# EAGLE schematic digital (EAGLE 7.4.0)
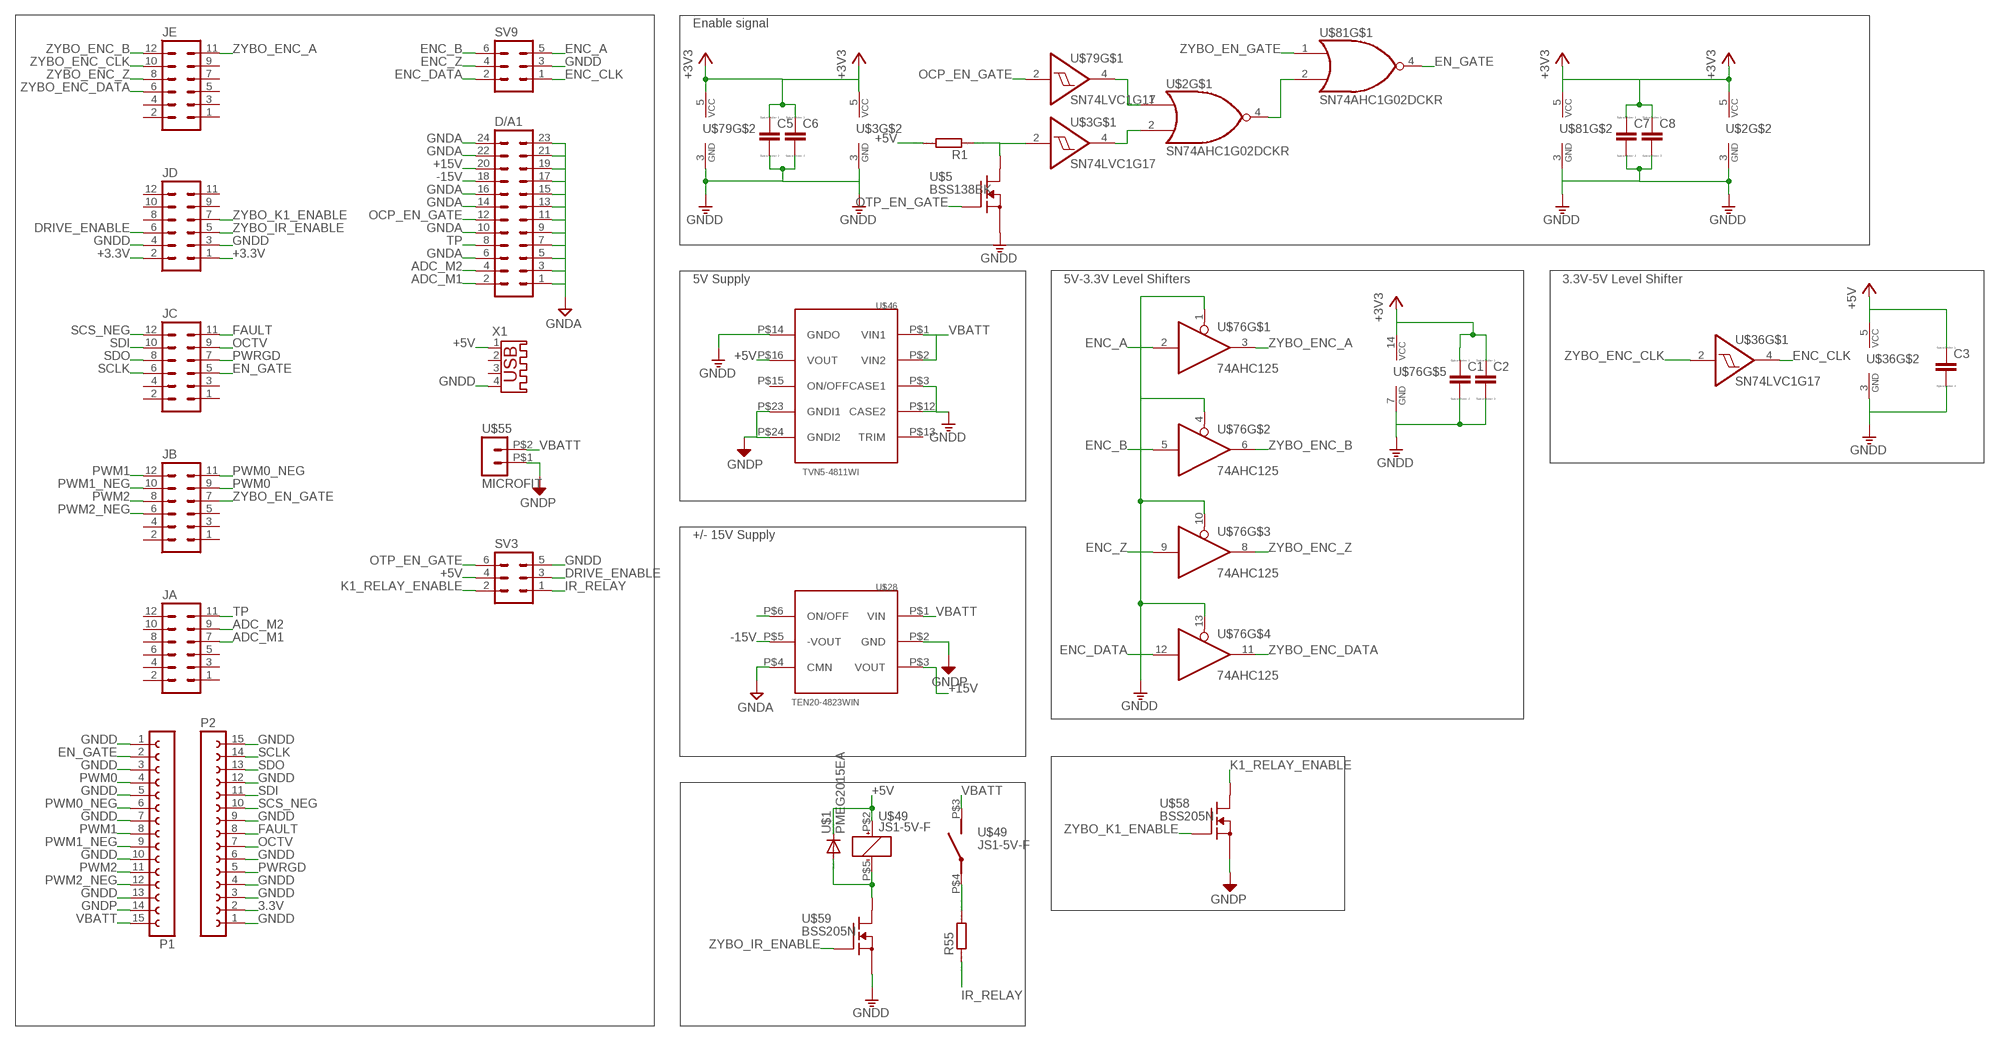
[diagram p0: schematic, sheet 1]

## Parts
C1  CC1206  [C1206]
C2  CC1206  [C1206]
C3  CC1206  [C1206]
C5  CC1206  [C1206]
C6  CC1206  [C1206]
C7  CC1206  [C1206]
C8  CC1206  [C1206]
D/A1  MA12-2  [MA12-2]
JA  MA06-2  [MA06-2]
JB  MA06-2  [MA06-2]
JC  MA06-2  [MA06-2]
JD  MA06-2  [MA06-2]
JE  MA06-2  [MA06-2]
P1  FE15-1  [FE15]
P2  FE15-1  [FE15]
R1  RR1206  [R1206]
R55  RR1206  [R1206]
SV3  MA03-2  [MA03-2]
SV9  MA03-2  [MA03-2]
U$1  PMEG2015EA  [SOD323_ST]
U$2  SN74AHC1G02DCKR  [SOT23-5]
U$3  SN74LVC1G17  [SOT23-5L]
U$5  BSS138BK  [SOT23]
U$28  TEN20-4823WIN  [TEN20-4823]
U$36  SN74LVC1G17  [SOT23-5L]
U$46  TVN5-4811WI  [DIP24]
U$49  JS1-5V-F  [JS1-5V-F]
U$55  MICROFIT  [MICROFIT-3.0]
U$58  BSS205N  [SOT23]
U$59  BSS205N  [SOT23]
U$76  74AHC125  [SO14]
U$79  SN74LVC1G17  [SOT23-5L]
U$81  SN74AHC1G02DCKR  [SOT23-5]
X1  USB-A003  [USB-A003]

## Nets
3.3V: P2.2
+3.3V: JD.1 JD.2
+3V3: C1.1 C2.1 C5.1 C6.1 C7.1 C8.1 U$2.5(VCC) U$3.5(VCC) U$76.14(VCC) U$79.5(VCC) U$81.5(VCC)
+5V: C3.1 R1.2 SV3.4 U$1.C U$36.5(VCC) U$46.P$16(VOUT) U$49.P$2(+) X1.1
+15V: D/A1.20 U$28.P$3(VOUT)
-15V: D/A1.18 U$28.P$5(-VOUT)
ADC_M1: D/A1.2 JA.7
ADC_M2: D/A1.4 JA.9
DRIVE_ENABLE: JD.6 SV3.3
EN_GATE: JC.5 P1.2 U$81.4(O)
ENC_A: SV9.5 U$76.2(I)
ENC_B: SV9.6 U$76.5(I)
ENC_CLK: SV9.1 U$36.4(O)
ENC_DATA: SV9.2 U$76.12(I)
ENC_Z: SV9.4 U$76.9(I)
FAULT: JC.11 P2.8
GNDA: D/A1.1 D/A1.3 D/A1.5 D/A1.6 D/A1.7 D/A1.9 D/A1.10 D/A1.11 D/A1.13 D/A1.14 D/A1.15 D/A1.16 D/A1.22 D/A1.23 D/A1.24 U$28.P$4(CMN)
GNDD: C1.2 C2.2 C3.2 C5.2 C6.2 C7.2 C8.2 JD.3 JD.4 P1.1 P1.3 P1.5 P1.7 P1.10 P1.13 P2.1 P2.3 P2.4 P2.6 P2.9 P2.12 P2.15 SV3.5 SV9.3 U$2.3(GND) U$3.3(GND) U$5.2(S) U$36.3(GND) U$46.P$3(CASE1) U$46.P$12(CASE2) U$46.P$14(GNDO) U$59.2(S) U$76.1(OE) U$76.4(OE) U$76.7(GND) U$76.10(OE) U$76.13(OE) U$79.3(GND) U$81.3(GND) X1.4
GNDP: P1.14 U$28.P$2(GND) U$46.P$23(GNDI1) U$46.P$24(GNDI2) U$55.P$1 U$58.2(S)
IR_RELAY: R55.1 SV3.1
K1_RELAY_ENABLE: SV3.2 U$58.3(D)
N$1: R1.1 U$3.2(I) U$5.3(D)
N$3: U$2.1(I0) U$79.4(O)
N$4: U$2.2(I1) U$3.4(O)
N$5: U$2.4(O) U$81.2(I1)
N$42: U$28.P$6(ON/OFF)
N$46: R55.2 U$49.P$4(P)
N$66: U$1.A U$49.P$5(-) U$59.3(D)
N$80: D/A1.21
N$81: D/A1.19
N$82: D/A1.17
OCP_EN_GATE: D/A1.12 U$79.2(I)
OCTV: JC.9 P2.7
OTP_EN_GATE: SV3.6 U$5.1(G)
PWM0: JB.9 P1.4
PWM0_NEG: JB.11 P1.6
PWM1: JB.12 P1.8
PWM1_NEG: JB.10 P1.9
PWM2: JB.8 P1.11
PWM2_NEG: JB.6 P1.12
PWRGD: JC.7 P2.5
SCLK: JC.6 P2.14
SCS_NEG: JC.12 P2.10
SDI: JC.10 P2.11
SDO: JC.8 P2.13
TP: D/A1.8 JA.11
VBATT: P1.15 U$28.P$1(VIN) U$46.P$1(VIN1) U$46.P$2(VIN2) U$49.P$3(S) U$55.P$2
ZYBO_EN_GATE: JB.7 U$81.1(I0)
ZYBO_ENC_A: JE.11 U$76.3(O)
ZYBO_ENC_B: JE.12 U$76.6(O)
ZYBO_ENC_CLK: JE.10 U$36.2(I)
ZYBO_ENC_DATA: JE.6 U$76.11(O)
ZYBO_ENC_Z: JE.8 U$76.8(O)
ZYBO_IR_ENABLE: JD.5 U$59.1(G)
ZYBO_K1_ENABLE: JD.7 U$58.1(G)
Unconnected: JA.1 JA.2 JA.3 JA.4 JA.5 JA.6 JA.8 JA.10 JA.12 JB.1 JB.2 JB.3 JB.4 JB.5 JC.1 JC.2 JC.3 JC.4 JD.8 JD.9 JD.10 JD.11 JD.12 JE.1 JE.2 JE.3 JE.4 JE.5 JE.7 JE.9 U$46.P$13(TRIM) U$46.P$15(ON/OFF) X1.2 X1.3

## Notes on the sheet
- Enable signal
- 5V Supply | 5V-3.3V Level Shifters | 3.3V-5V Level Shifter
- +/- 15V Supply

## Library data of the parts
C1-C3 C5-C8 = eagle-ltspice:C: CAPACITOR, European symbol; SPICEMODEL: NONE; SPICEPREFIX: C
D/A1 = con-lstb:MA12-2: PIN HEADER; OC_FARNELL: unknown; OC_NEWARK: unknown
JA JB JC JD JE = con-lstb:MA06-2: PIN HEADER; OC_FARNELL: unknown; OC_NEWARK: unknown
P1 P2 = con-lsta:FE15-1: FEMALE HEADER; OC_FARNELL: unknown; OC_NEWARK: unknown
R1 R55 = eagle-ltspice:R: RESISTOR, European symbol; SPICEMODEL: NONE; SPICEPREFIX: R
SV3 SV9 = con-lstb:MA03-2: PIN HEADER; OC_FARNELL: unknown; OC_NEWARK: unknown
U$1 = custom_parts:PMEG2015EA
U$2 U$81 = custom_parts:SN74AHC1G02DCKR
U$3 U$36 U$79 = custom_parts:SN74LVC1G17
U$5 = custom_parts:BSS138BK
U$28 = custom_parts:TEN20-4823WIN
U$46 = custom_parts:TVN5-4811WI
U$49 = custom_parts:JS1-5V-F
U$55 = custom_parts:MICROFIT
U$58 U$59 = custom_parts:BSS205N
U$76 = custom_parts:74AHC125
X1 = con-yamaichi:USB-A003: USB connector; OC_FARNELL: unknown; OC_NEWARK: unknown